# Altium schematic sheet gpio.SchDoc
size A4; Organization: Altium Limited; Address1: L3, 12a Rodborough Rd; Address2: Frenchs Forest; Address3: NSW; Address4: Australia 2086; SheetNumber: 7; SheetTotal: 8
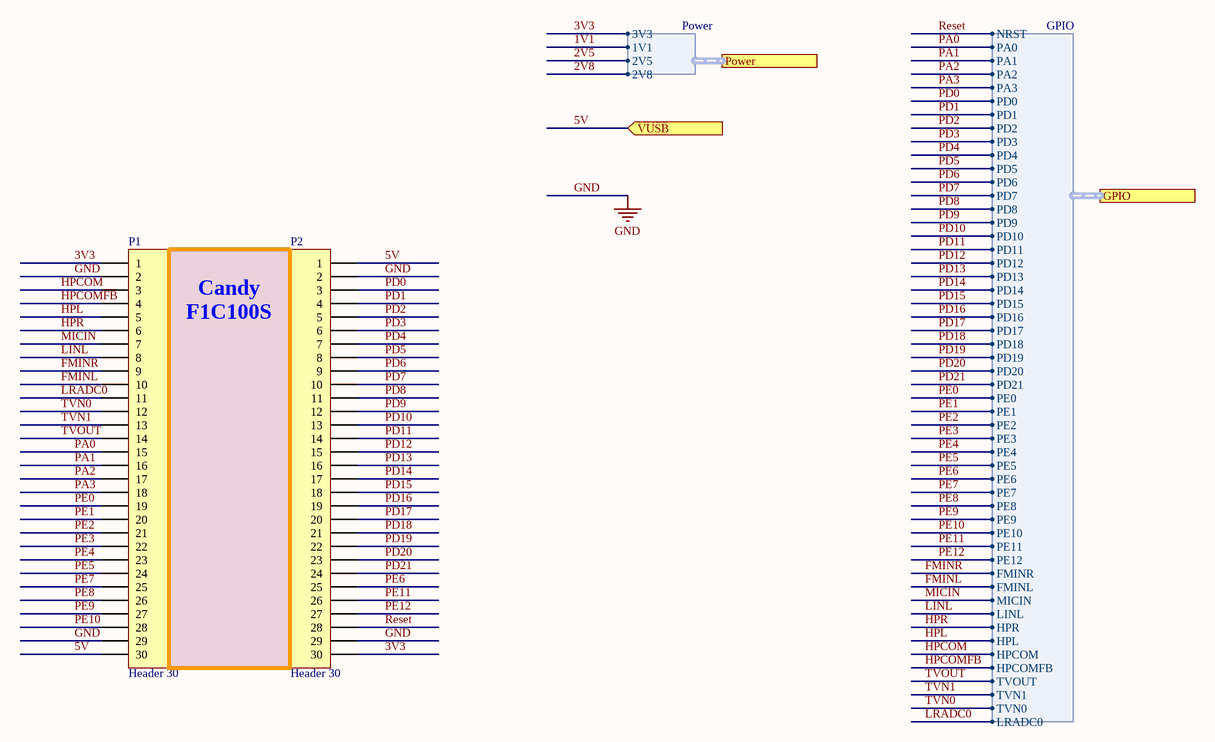
[diagram p0: gpio.SchDoc]

## Parts
P1  Header 30  [HDR1X30]
P2  Header 30  [HDR1X30]

## Ports
GPIO (harness GPIO), Power (harness Power), VUSB (in)

## Harnesses
Power: 3V3, 1V1, 2V5, 2V8
GPIO: PA0, PA1, PA2, PA3, PD0, PD1, PD2, PD3, PD4, PD5, PD6, PD7, PD8, PD9, PD10, PD11, PD12, PD13, PD14, PD15, PD16, PD17, PD18, PD19, PD20, PD21, PE0, PE1, PE2, PE3, PE4, PE5, PE6, PE7, PE8, PE9, PE10, PE11, PE12, NRST, FMINR, FMINL, MICIN, LINL, HPR, HPL, HPCOM, HPCOMFB, TVOUT, TVN0, TVN1, LRADC0

## Nets
GND: P1.2 P1.29 P2.2 P2.29
1V1: port Power.1V1
2V5: port Power.2V5
2V8: port Power.2V8
3V3: P1.1 P2.30 ; port Power.3V3
5V: P1.30 P2.1 ; port VUSB
FMINL: P1.10 ; port GPIO.FMINL
FMINR: P1.9 ; port GPIO.FMINR
HPCOM: P1.3 ; port GPIO.HPCOM
HPCOMFB: P1.4 ; port GPIO.HPCOMFB
HPL: P1.5 ; port GPIO.HPL
HPR: P1.6 ; port GPIO.HPR
LINL: P1.8 ; port GPIO.LINL
LRADC0: P1.11 ; port GPIO.LRADC0
MICIN: P1.7 ; port GPIO.MICIN
PA0: P1.15 ; port GPIO.PA0
PA1: P1.16 ; port GPIO.PA1
PA2: P1.17 ; port GPIO.PA2
PA3: P1.18 ; port GPIO.PA3
PD0: P2.3 ; port GPIO.PD0
PD1: P2.4 ; port GPIO.PD1
PD2: P2.5 ; port GPIO.PD2
PD3: P2.6 ; port GPIO.PD3
PD4: P2.7 ; port GPIO.PD4
PD5: P2.8 ; port GPIO.PD5
PD6: P2.9 ; port GPIO.PD6
PD7: P2.10 ; port GPIO.PD7
PD8: P2.11 ; port GPIO.PD8
PD9: P2.12 ; port GPIO.PD9
PD10: P2.13 ; port GPIO.PD10
PD11: P2.14 ; port GPIO.PD11
PD12: P2.15 ; port GPIO.PD12
PD13: P2.16 ; port GPIO.PD13
PD14: P2.17 ; port GPIO.PD14
PD15: P2.18 ; port GPIO.PD15
PD16: P2.19 ; port GPIO.PD16
PD17: P2.20 ; port GPIO.PD17
PD18: P2.21 ; port GPIO.PD18
PD19: P2.22 ; port GPIO.PD19
PD20: P2.23 ; port GPIO.PD20
PD21: P2.24 ; port GPIO.PD21
PE0: P1.19 ; port GPIO.PE0
PE1: P1.20 ; port GPIO.PE1
PE2: P1.21 ; port GPIO.PE2
PE3: P1.22 ; port GPIO.PE3
PE4: P1.23 ; port GPIO.PE4
PE5: P1.24 ; port GPIO.PE5
PE6: P2.25 ; port GPIO.PE6
PE7: P1.25 ; port GPIO.PE7
PE8: P1.26 ; port GPIO.PE8
PE9: P1.27 ; port GPIO.PE9
PE10: P1.28 ; port GPIO.PE10
PE11: P2.26 ; port GPIO.PE11
PE12: P2.27 ; port GPIO.PE12
Reset: P2.28 ; port GPIO.NRST
TVN0: P1.12 ; port GPIO.TVN0
TVN1: P1.13 ; port GPIO.TVN1
TVOUT: P1.14 ; port GPIO.TVOUT

## Notes on the sheet
- Candy
  F1C100S
- Title
- Size:
- Date:
- A4
- Number:
- Time:
- Revision:
- Sheet
- of
- File:

## Library data of the parts
P1 P2 = Header 30: Header, 30-Pin; LatestRevisionDate: 17-Jul-2002; LatestRevisionNote: Re-released for DXP Platform.; Publisher: Altium Limited